# Altium schematic sheet Rear.SchDoc
size A4
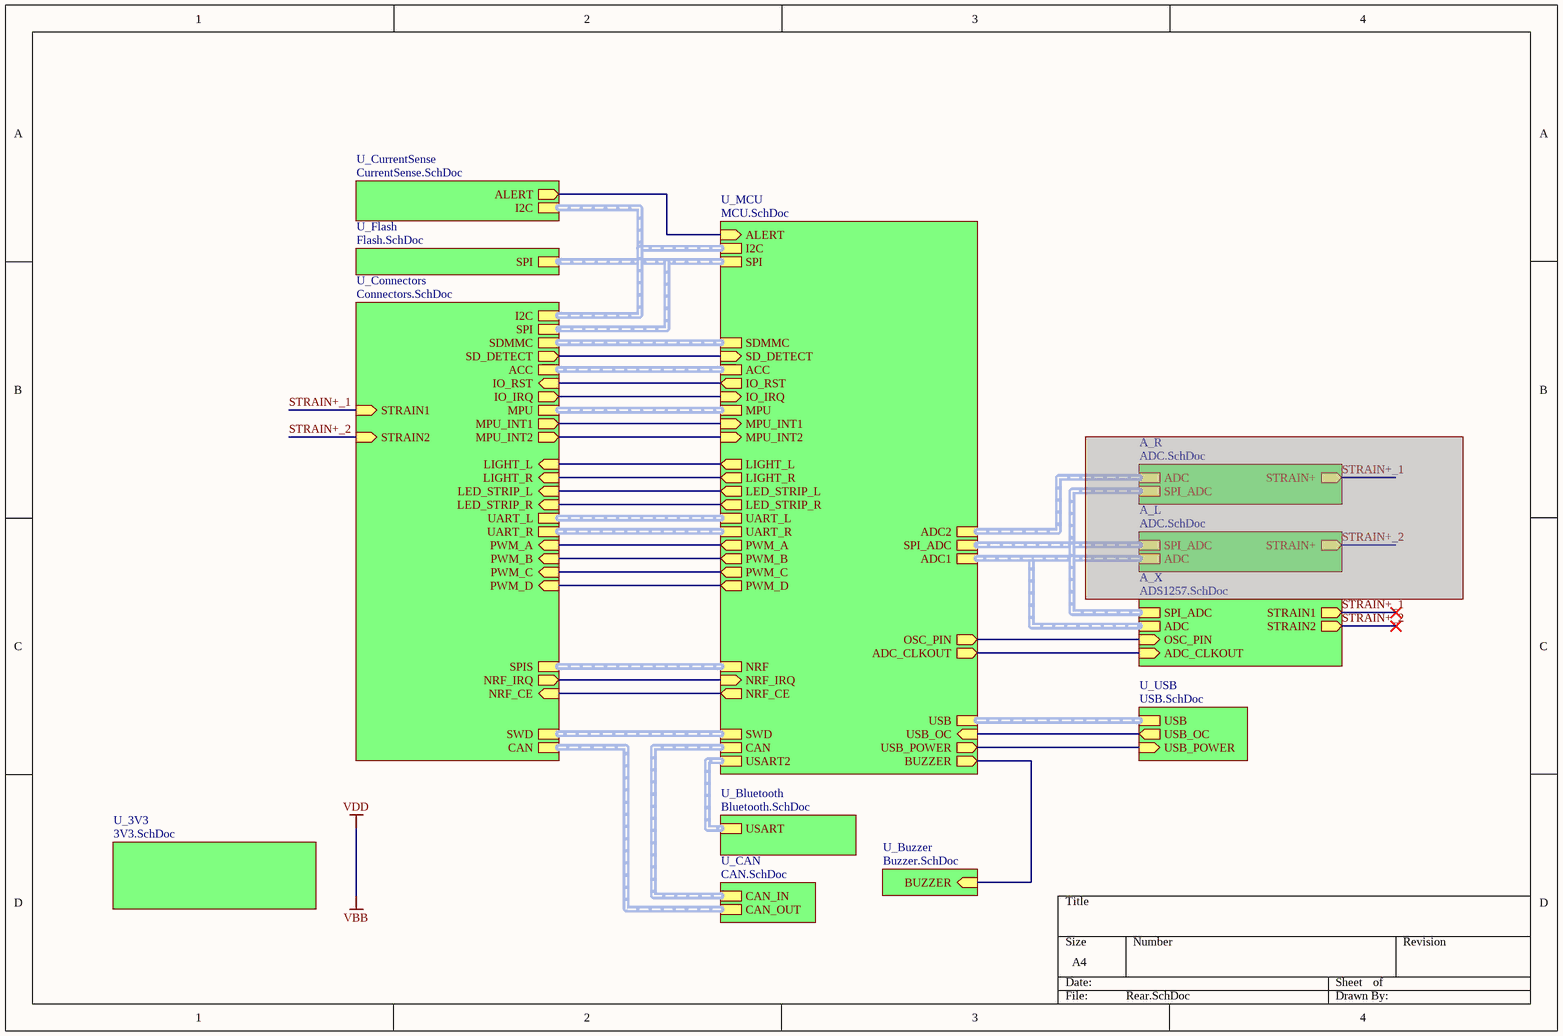
[diagram p0: Rear.SchDoc]

## Sub-sheets
A_L = ADC.SchDoc (masked out): SPI_ADC (harness SPI_ADC), ADC (harness ADC), STRAIN+ (out)
A_R = ADC.SchDoc (masked out): SPI_ADC (harness SPI_ADC), ADC (harness ADC), STRAIN+ (out)
A_X = ADS1257.SchDoc: SPI_ADC (harness SPI_ADC), ADC (harness ADC), STRAIN1 (out), STRAIN2 (out), OSC_PIN (in), ADC_CLKOUT (in)
U_3V3 = 3V3.SchDoc: no entries
U_Bluetooth = Bluetooth.SchDoc: USART (harness USART2)
U_Buzzer = Buzzer.SchDoc: BUZZER (in)
U_CAN = CAN.SchDoc: CAN_IN (harness CAN Input), CAN_OUT (harness CAN Output)
U_Connectors = Connectors.SchDoc: CAN (harness CAN Output), MPU (harness I2C), MPU_INT1 (out), MPU_INT2 (out), STRAIN1 (in), STRAIN2 (in), LED_STRIP_L (in), LED_STRIP_R (in), IO_RST (in), IO_IRQ (out), LIGHT_L (in), LIGHT_R (in), SPIS (harness SPI), SDMMC (harness SDMMC), SD_DETECT (out), NRF_CE (in), NRF_IRQ (out), UART_L (harness USART2), UART_R (harness USART2), PWM_A (in), PWM_B (in), PWM_C (in), PWM_D (in), SPI (harness SPI), I2C, ACC, SWD
U_CurrentSense = CurrentSense.SchDoc: ALERT (out), I2C (harness I2C)
U_Flash = Flash.SchDoc: SPI (harness SPI)
U_MCU = MCU.SchDoc: CAN (harness CAN Input), ACC (harness Accessory Outputs), I2C (harness I2C), SPI_ADC (harness SPI_ADC), USART2 (harness USART2), ADC1 (harness ADC), ADC2 (harness ADC), MPU (harness I2C), MPU_INT1 (in), MPU_INT2 (in), SPI, LED_STRIP_L (out), LED_STRIP_R (out), IO_RST (out), IO_IRQ (in), LIGHT_L (out), LIGHT_R (out), NRF (harness SPI), SD_DETECT (in), NRF_CE (out), NRF_IRQ (in), OSC_PIN (out), UART_L (harness USART2), UART_R (harness USART2), PWM_A (out), PWM_B (out), USB (harness USB), BUZZER (out), USB_POWER (out), USB_OC (in), SDMMC, ALERT (in), PWM_C (out), PWM_D (out), SWD (harness SWD), ADC_CLKOUT (out)
U_USB = USB.SchDoc: USB_POWER (in), USB_OC (out), USB (harness USB)

## Nets
STRAIN+_1: sheet A_X/STRAIN1, sheet U_Connectors/STRAIN1
STRAIN+_2: sheet A_X/STRAIN2, sheet U_Connectors/STRAIN2
(unnamed): sheet A_X/OSC_PIN, sheet U_MCU/OSC_PIN
(unnamed): sheet A_X/ADC_CLKOUT, sheet U_MCU/ADC_CLKOUT
(unnamed): sheet U_MCU/MPU_INT1, sheet U_Connectors/MPU_INT1
(unnamed): sheet U_MCU/MPU_INT2, sheet U_Connectors/MPU_INT2
(unnamed): sheet U_MCU/LED_STRIP_L, sheet U_Connectors/LED_STRIP_L
(unnamed): sheet U_MCU/LED_STRIP_R, sheet U_Connectors/LED_STRIP_R
(unnamed): sheet U_MCU/IO_RST, sheet U_Connectors/IO_RST
(unnamed): sheet U_MCU/IO_IRQ, sheet U_Connectors/IO_IRQ
(unnamed): sheet U_MCU/LIGHT_L, sheet U_Connectors/LIGHT_L
(unnamed): sheet U_MCU/LIGHT_R, sheet U_Connectors/LIGHT_R
(unnamed): sheet U_MCU/SD_DETECT, sheet U_Connectors/SD_DETECT
(unnamed): sheet U_MCU/NRF_CE, sheet U_Connectors/NRF_CE
(unnamed): sheet U_MCU/NRF_IRQ, sheet U_Connectors/NRF_IRQ
(unnamed): sheet U_MCU/PWM_A, sheet U_Connectors/PWM_A
(unnamed): sheet U_MCU/PWM_B, sheet U_Connectors/PWM_B
(unnamed): sheet U_MCU/BUZZER, sheet U_Buzzer/BUZZER
(unnamed): sheet U_MCU/USB_POWER, sheet U_USB/USB_POWER
(unnamed): sheet U_MCU/USB_OC, sheet U_USB/USB_OC
(unnamed): sheet U_MCU/ALERT, sheet U_CurrentSense/ALERT
(unnamed): sheet U_MCU/PWM_C, sheet U_Connectors/PWM_C
(unnamed): sheet U_MCU/PWM_D, sheet U_Connectors/PWM_D

## Buses and harness runs
harness sheet A_X/ADC = sheet U_MCU/ADC1
harness sheet A_X/SPI_ADC = sheet U_MCU/SPI_ADC
harness sheet U_Bluetooth/USART = sheet U_MCU/USART2
harness sheet U_CAN/CAN_IN = sheet U_MCU/CAN
harness sheet U_CAN/CAN_OUT = sheet U_Connectors/CAN
harness sheet U_Connectors/ACC = sheet U_MCU/ACC
harness sheet U_Connectors/I2C = sheet U_CurrentSense/I2C = sheet U_MCU/I2C
harness sheet U_Connectors/MPU = sheet U_MCU/MPU
harness sheet U_Connectors/SDMMC = sheet U_MCU/SDMMC
harness sheet U_Connectors/SPI = sheet U_Flash/SPI = sheet U_MCU/SPI
harness sheet U_Connectors/SPIS = sheet U_MCU/NRF
harness sheet U_Connectors/SWD = sheet U_MCU/SWD
harness sheet U_Connectors/UART_L = sheet U_MCU/UART_L
harness sheet U_Connectors/UART_R = sheet U_MCU/UART_R
harness sheet U_MCU/USB = sheet U_USB/USB